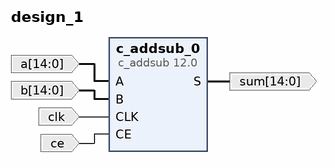
[diagram p0: block diagram of the top level]
# Vivado block design design_1, xc7vx485tffg1157-1, Vivado 2017.4
create_bd_design design_1

create_bd_port -dir I clk
create_bd_port -dir I ce
create_bd_port -dir I -from 14 -to 0 a
create_bd_port -dir I -from 14 -to 0 b
create_bd_port -dir O -from 14 -to 0 sum

create_bd_cell -type ip -vlnv xilinx.com:ip:c_addsub:12.0 c_addsub_0

# ---- connections ----

connect_bd_net [get_bd_ports a] [get_bd_pins c_addsub_0/A]
connect_bd_net [get_bd_ports b] [get_bd_pins c_addsub_0/B]
connect_bd_net [get_bd_ports clk] [get_bd_pins c_addsub_0/CLK]
connect_bd_net [get_bd_ports ce] [get_bd_pins c_addsub_0/CE]
connect_bd_net [get_bd_pins c_addsub_0/S] [get_bd_ports sum]

validate_bd_design
save_bd_design
